# Altium schematic sheet EEPROM.SchDoc
size A4; SheetNumber: 7; SheetTotal: 11
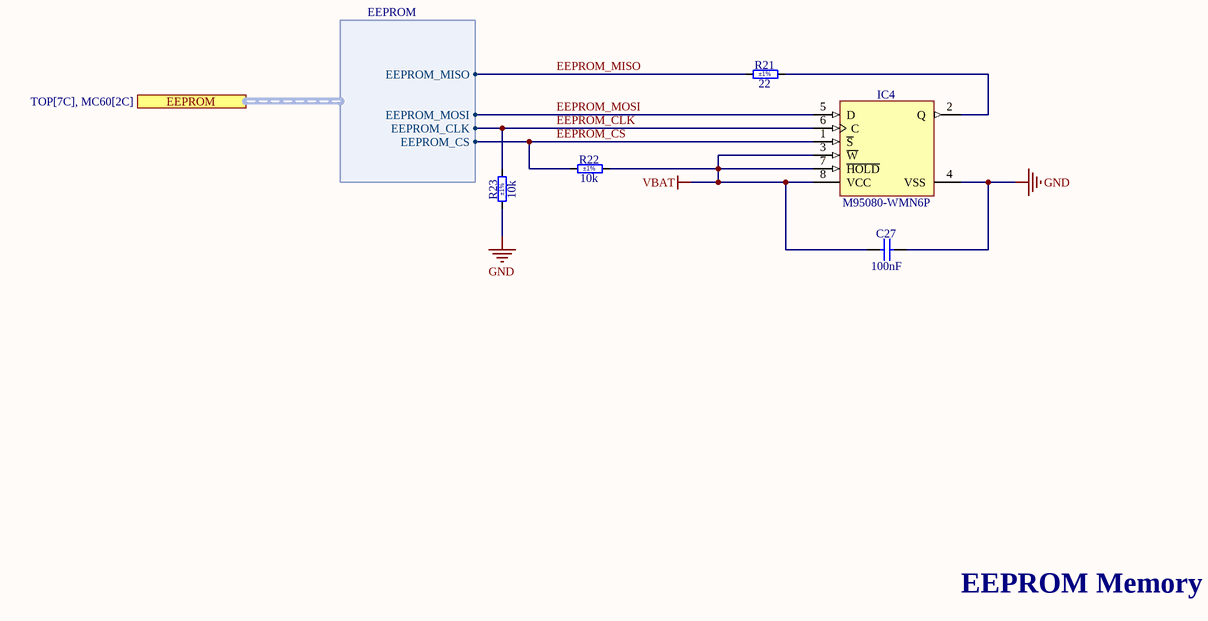
[diagram p0: EEPROM.SchDoc]

## Parts
C27  100nF  [CAPC1608X87N]
IC4  M95080-WMN6P  [SOIC127P600X175-8N]
R21  22  Tolerance: ±1%  [RESC1608X55N]
R22  10k  Tolerance: ±1%  [RESC1608X55N]
R23  10k  Tolerance: ±1%  [RESC1608X55N]

## Ports
EEPROM (harness EEPROM, see TOP[7C], MC60[2C])

## Harnesses
EEPROM: EEPROM_MISO, EEPROM_MOSI, EEPROM_CLK, EEPROM_CS

## Nets
GND: C27.2 IC4.4(VSS) R23.1
VBAT: C27.1 IC4.3(~{W}) IC4.7(~{HOLD}) IC4.8(VCC) R22.2
EEPROM_CLK: IC4.6(C) R23.2 ; port EEPROM.EEPROM_CLK
EEPROM_CS: IC4.1(~{S}) R22.1 ; port EEPROM.EEPROM_CS
EEPROM_MISO: R21.1 ; port EEPROM.EEPROM_MISO
EEPROM_MOSI: IC4.5(D) ; port EEPROM.EEPROM_MOSI
NetIC4_2: IC4.2(Q) R21.2

## Notes on the sheet
- EEPROM Memory

## Library data of the parts
C27 = CC0603_100NF_50V_10%_X7R: Non-polarised capacitor; Part Description: SMD Multilayer Chip Ceramic Capacitor; Manufacturer: GENERIC; Manufacturer1 Part Number: 223858615649; Voltage: 50V; TC: X7R; Tolerance: ±10%; Part Number: CC0603_100NF_50V_10%_X7R; Component Kind: Standard; Component Type: Standard; Pin Count: 2; Value: 100nF; Status: Preferred; Manufacturer Part Number: CC0603_100NF_50V_10%_X7R; Case: 0603; Mounted: Yes; Socket: No; SMD: Yes; Sense: No; Manufacturer1 Example: PHYCOMP; Manufacturer1 ComponentHeight: 0.87mm; HelpURL: \\cern.ch\dfs\Applications\Altium\Datasheets\CC0603_X7R_PHYCOMP.pdf; Author: CERN DEM JLC; CreateDate: 03.12.2007; LatestRevisionDate: 03.12.2007
IC4 = M95080-WMN6P: 2.5 to 5.5 V, 8Kb (1024x8) Serial SPI Bus EEPROM with High-Speed Clock; Manufacturer: ST MICROELECTRONICS; PressFit: No; Bonding: No; Part Number: M95080-WMN6P; Component Kind: Standard; Component Type: Standard; Device: M95080-WMN6P; PackageDescription: SOIC, 1.27mm Pitch; 8 Pin - Body 4x5mm, IPC Medium Density; Part Description: 2.5 to 5.5V, 8Kb (1024x8) Serial SPI Bus EEPROM with High-Speed Clock; Manufacturer Part Number: M95080-WMN6P; Pin Count: 8; Case: SOIC8; Mounted: Yes; Socket: No; SMD: Yes; Sense: No; ComponentHeight: 1.75mm; HelpURL: \\cern.ch\dfs\Applications\Altium\Datasheets\M95080-WMN6P.pdf; Author: CERN DEM JLC; CreateDate: 20.06.2017; LatestRevisionDate: 20.06.2017
R21 = R0603_22R_1%_0.1W_100PPM: Resistor - 1%; Part Description: General Purpose Thick Film Chip Resistor; Manufacturer: GENERIC; Manufacturer1 Part Number: NRC06F22R0TRF; Power: 0.1W; TC: ±100ppm/°C; PressFit: No; Part Number: R0603_22R_1%_0.1W_100PPM; Component Kind: Standard; Component Type: Standard; Pin Count: 2; Value: 22; Status: Preferred; Manufacturer Part Number: R0603_22R_1%_0.1W_100PPM; Case: 0603; Mounted: Yes; Sense: No; Socket: No; SMD: Yes; Manufacturer1 Example: NIC COMPONENT; Manufacturer1 ComponentHeight: 0.55mm; HelpURL: \\cern.ch\dfs\Applications\Altium\Datasheets\R0603_NIC_NRC.pdf; Author: CERN DEM JLC; CreateDate: 03.12.2007; LatestRevisionDate: 13.03.2008
R22 R23 = R0603_10K_1%_0.1W_100PPM: Resistor - 1%; Part Description: General Purpose Thick Film Chip Resistor; Manufacturer: GENERIC; Manufacturer1 Part Number: NRC06F1002TRF; Power: 0.1W; TC: ±100ppm/°C; PressFit: No; Part Number: R0603_10K_1%_0.1W_100PPM; Component Kind: Standard; Component Type: Standard; Pin Count: 2; Value: 10k; Status: Preferred; Manufacturer Part Number: R0603_10K_1%_0.1W_100PPM; Case: 0603; Mounted: Yes; Sense: No; Socket: No; SMD: Yes; Manufacturer1 Example: NIC COMPONENT; Manufacturer1 ComponentHeight: 0.55mm; HelpURL: \\cern.ch\dfs\Applications\Altium\Datasheets\R0603_NIC_NRC.pdf; Author: CERN DEM JLC; CreateDate: 03.12.2007; LatestRevisionDate: 13.03.2008